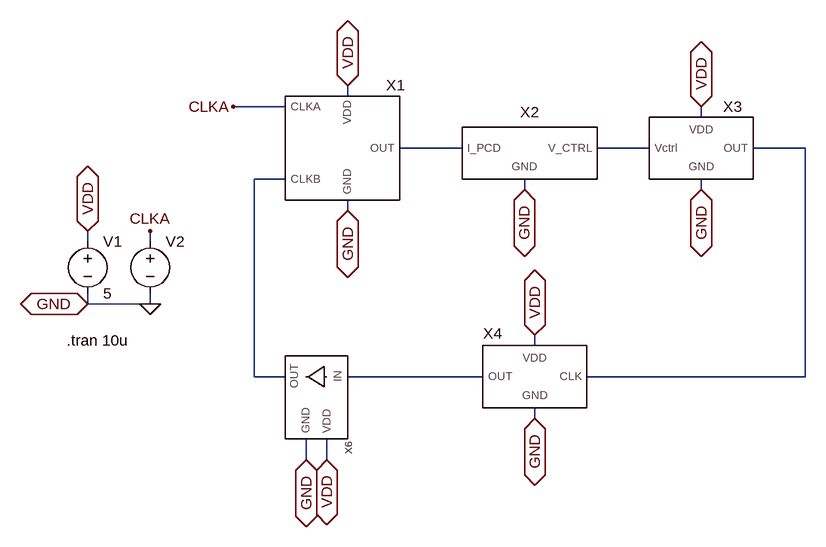
[diagram p0: schematic pll.asc]
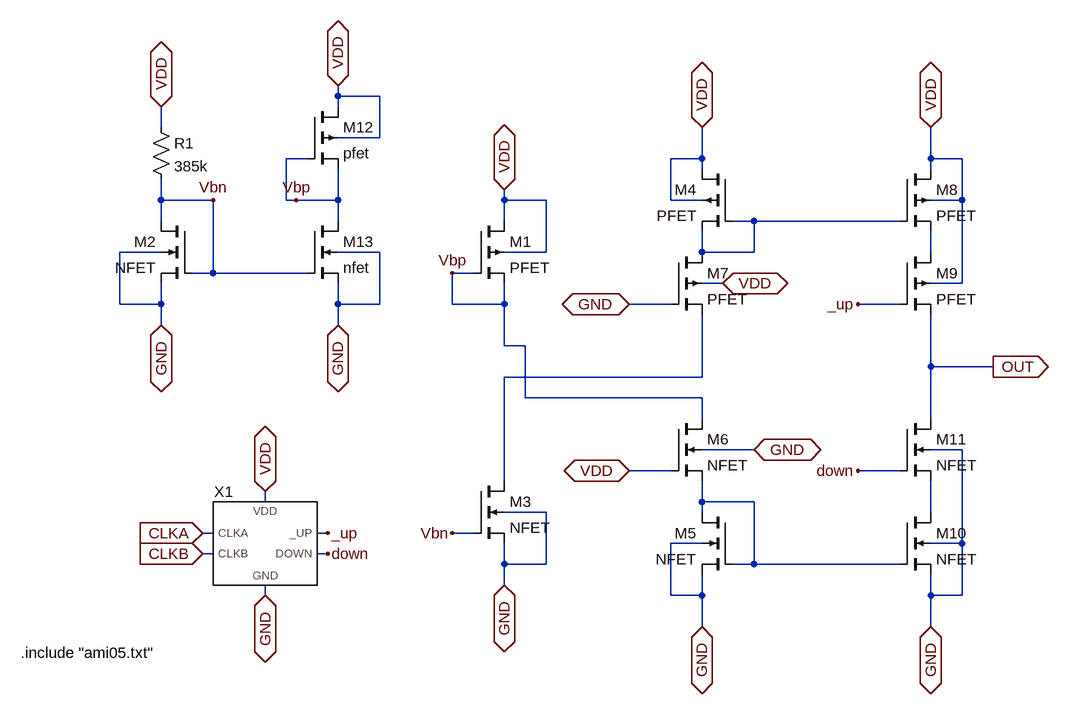
[diagram p1: sub-circuit chargepump.asc]
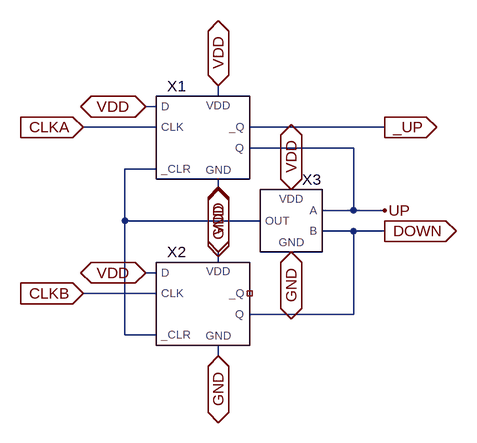
[diagram p2: sub-circuit phasedetector.asc]
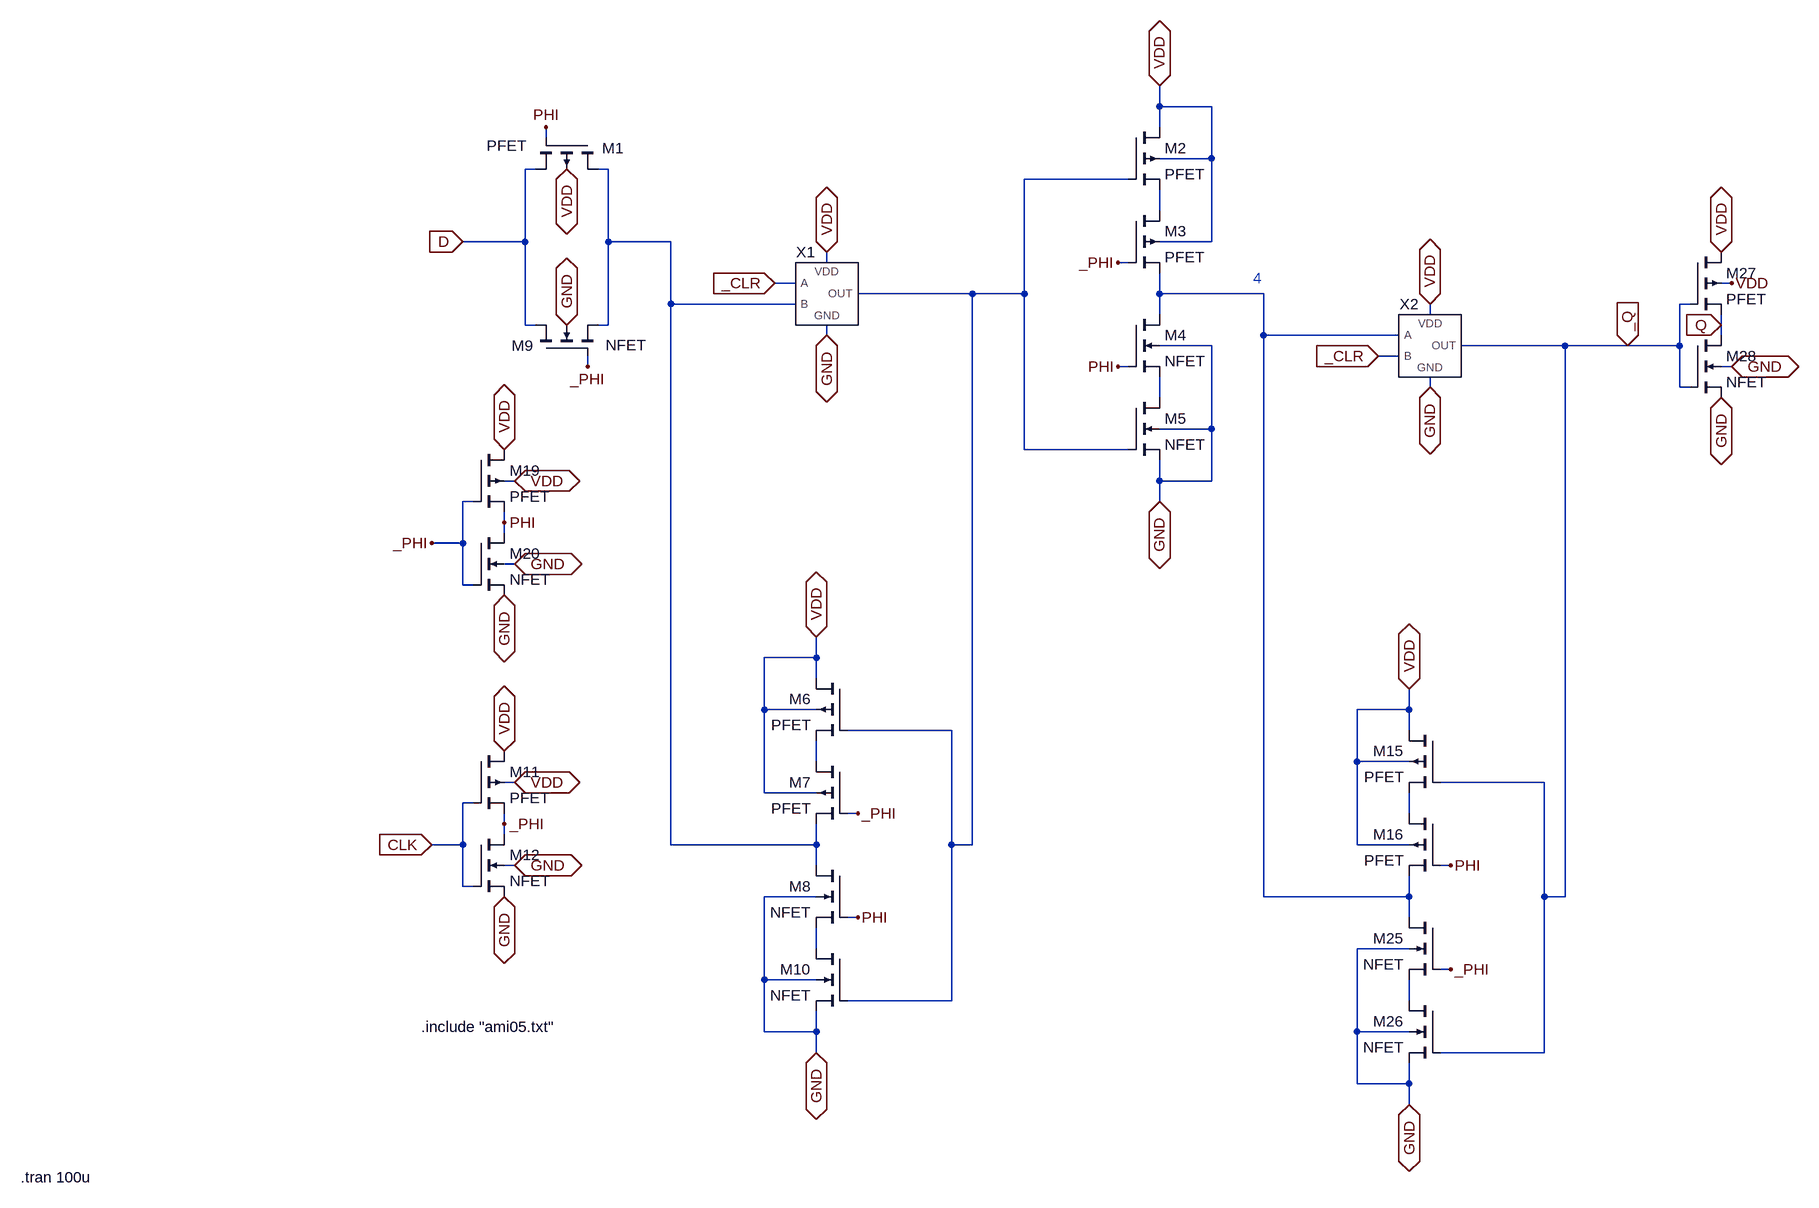
[diagram p3: sub-circuit ffd.asc]
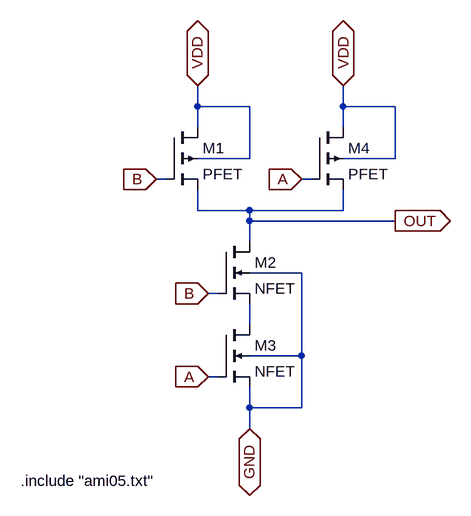
[diagram p4: sub-circuit nand.asc]
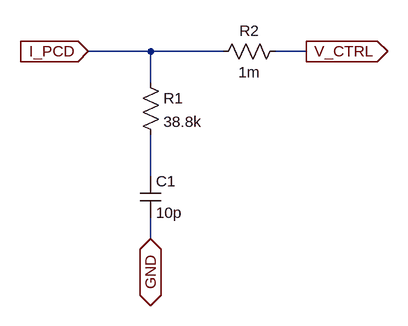
[diagram p5: sub-circuit f_l.asc]
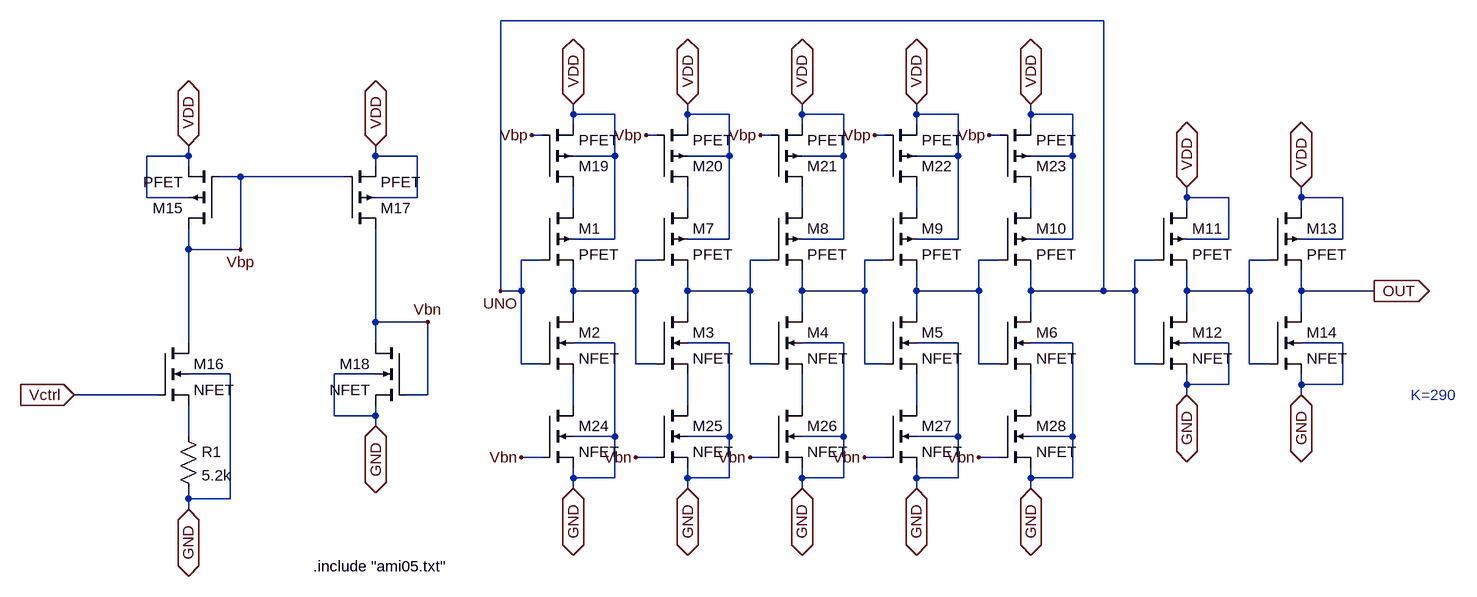
[diagram p6: sub-circuit vco.asc]
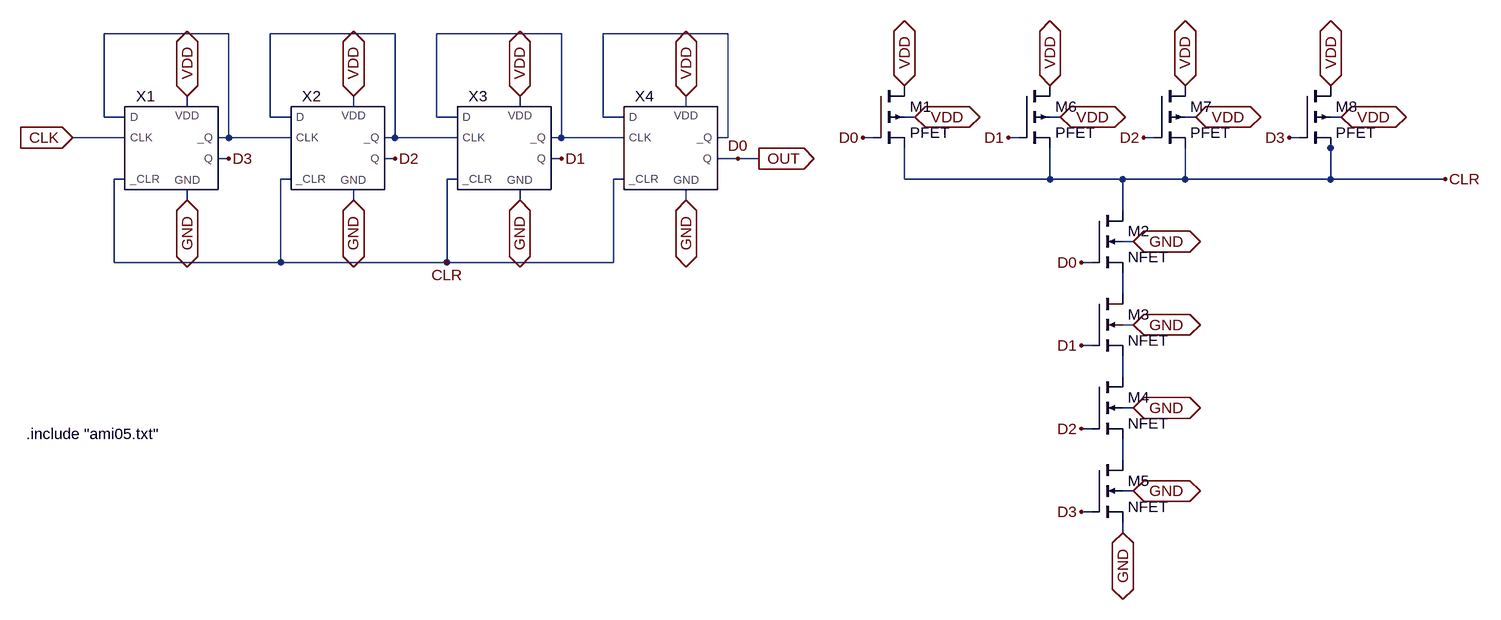
[diagram p7: sub-circuit divisor.asc]
pll.asc, the LTspice schematic file:
Version 4
SHEET 1 880 680
WIRE 48 -32 48 -48
WIRE -48 -16 -128 -16
WIRE 592 0 592 -16
WIRE 224 48 128 48
WIRE 512 48 432 48
WIRE 752 48 672 48
WIRE -48 96 -96 96
WIRE 320 112 320 96
WIRE 592 112 592 96
WIRE 48 144 48 128
WIRE -352 192 -352 176
WIRE -256 192 -256 176
WIRE -352 288 -352 272
WIRE -256 288 -256 272
WIRE -256 288 -352 288
WIRE 336 352 336 336
WIRE -96 400 -96 96
WIRE -48 400 -96 400
WIRE 256 400 48 400
WIRE 752 400 752 48
WIRE 752 400 416 400
WIRE 336 464 336 448
WIRE -16 528 -16 496
WIRE 16 528 16 496
FLAG -256 288 0
FLAG -256 176 CLKA
FLAG -352 176 VDD
IOPIN -352 176 BiDir
FLAG -352 288 GND
IOPIN -352 288 BiDir
FLAG 48 -48 VDD
IOPIN 48 -48 BiDir
FLAG 48 144 GND
IOPIN 48 144 BiDir
FLAG 320 112 GND
IOPIN 320 112 BiDir
FLAG 592 112 GND
IOPIN 592 112 BiDir
FLAG 336 464 GND
IOPIN 336 464 BiDir
FLAG 592 -16 VDD
IOPIN 592 -16 BiDir
FLAG 336 336 VDD
IOPIN 336 336 BiDir
FLAG -128 -16 CLKA
FLAG -16 528 GND
IOPIN -16 528 BiDir
FLAG 16 528 VDD
IOPIN 16 528 BiDir
SYMBOL voltage -352 176 R0
WINDOW 123 0 0 Left 0
WINDOW 39 0 0 Left 0
SYMATTR InstName V1
SYMATTR Value 5
SYMBOL voltage -256 176 R0
WINDOW 3 24 96 Invisible 2
WINDOW 123 0 0 Left 0
WINDOW 39 0 0 Left 0
SYMATTR Value PULSE(0 5 0 10p 10p 33.333n 66.666n)
SYMATTR InstName V2
SYMBOL chargePump 16 64 R0
SYMATTR InstName X1
SYMBOL f_l 320 48 R0
SYMATTR InstName X2
SYMBOL vco 592 48 R0
SYMATTR InstName X3
SYMBOL divisor 336 400 M0
SYMATTR InstName X4
SYMBOL buffer -16 448 R90
SYMATTR InstName X6
TEXT -384 344 Left 2 !.tran 10u

chargepump.asc, the sub-circuit schematic file:
Version 4
SHEET 1 1812 688
WIRE 240 -256 240 -272
WIRE 304 -256 240 -256
WIRE 240 -240 240 -256
WIRE -32 -208 -32 -240
WIRE 304 -192 304 -256
WIRE 304 -192 240 -192
WIRE 192 -160 160 -160
WIRE 800 -160 800 -208
WIRE 800 -160 752 -160
WIRE 1152 -160 1152 -208
WIRE 1200 -160 1152 -160
WIRE 800 -144 800 -160
WIRE 1152 -144 1152 -160
WIRE -32 -96 -32 -128
WIRE 48 -96 -32 -96
WIRE 160 -96 160 -160
WIRE 176 -96 160 -96
WIRE 240 -96 240 -144
WIRE 240 -96 176 -96
WIRE 496 -96 496 -112
WIRE 560 -96 496 -96
WIRE 752 -96 752 -160
WIRE 800 -96 752 -96
WIRE 1200 -96 1200 -160
WIRE 1200 -96 1152 -96
WIRE -32 -64 -32 -96
WIRE 240 -64 240 -96
WIRE 496 -64 496 -96
WIRE 880 -64 848 -64
WIRE 1104 -64 880 -64
WIRE -32 -16 -96 -16
WIRE 304 -16 240 -16
WIRE 560 -16 560 -96
WIRE 560 -16 496 -16
WIRE 800 -16 800 -48
WIRE 880 -16 880 -64
WIRE 880 -16 800 -16
WIRE 1152 -16 1152 -48
WIRE 48 16 48 -96
WIRE 48 16 16 16
WIRE 192 16 48 16
WIRE 448 16 416 16
WIRE 832 32 800 32
WIRE 1200 32 1200 -96
WIRE 1200 32 1152 32
WIRE -96 64 -96 -16
WIRE -32 64 -32 32
WIRE -32 64 -96 64
WIRE 240 64 240 32
WIRE 304 64 304 -16
WIRE 304 64 240 64
WIRE 416 64 416 16
WIRE 496 64 496 32
WIRE 496 64 416 64
WIRE 752 64 688 64
WIRE 1104 64 1040 64
WIRE -32 96 -32 64
WIRE 240 96 240 64
WIRE 496 128 496 64
WIRE 528 128 496 128
WIRE 1152 160 1152 80
WIRE 1248 160 1152 160
WIRE 800 176 800 80
WIRE 800 176 496 176
WIRE 528 208 528 128
WIRE 800 208 528 208
WIRE 800 240 800 208
WIRE 1152 240 1152 160
WIRE 880 288 800 288
WIRE 1200 288 1152 288
WIRE 752 320 688 320
WIRE 1104 320 1040 320
WIRE 496 336 496 176
WIRE 128 368 128 352
WIRE 800 368 800 336
WIRE 880 368 800 368
WIRE 560 384 496 384
WIRE 800 384 800 368
WIRE 1152 384 1152 336
WIRE 48 416 32 416
WIRE 224 416 208 416
WIRE 448 416 416 416
WIRE 800 432 752 432
WIRE 1200 432 1200 288
WIRE 1200 432 1152 432
WIRE 48 448 32 448
WIRE 224 448 208 448
WIRE 496 464 496 432
WIRE 560 464 560 384
WIRE 560 464 496 464
WIRE 880 464 880 368
WIRE 880 464 848 464
WIRE 1104 464 880 464
WIRE 496 496 496 464
WIRE 128 512 128 496
WIRE 752 512 752 432
WIRE 800 512 800 480
WIRE 800 512 752 512
WIRE 1152 512 1152 480
WIRE 1200 512 1200 432
WIRE 1200 512 1152 512
WIRE 800 560 800 512
WIRE 1152 560 1152 512
FLAG -32 -240 VDD
IOPIN -32 -240 BiDir
FLAG -32 96 GND
IOPIN -32 96 BiDir
FLAG 496 496 GND
IOPIN 496 496 BiDir
FLAG 48 -96 Vbn
FLAG 416 16 Vbp
FLAG 496 -112 VDD
IOPIN 496 -112 BiDir
FLAG 416 416 Vbn
FLAG 224 448 down
FLAG 128 352 VDD
IOPIN 128 352 BiDir
FLAG 128 512 GND
IOPIN 128 512 BiDir
FLAG 224 416 _up
FLAG 32 448 CLKB
IOPIN 32 448 In
FLAG 32 416 CLKA
IOPIN 32 416 In
FLAG 176 -96 Vbp
FLAG 240 96 GND
IOPIN 240 96 BiDir
FLAG 240 -272 VDD
IOPIN 240 -272 BiDir
FLAG 1040 64 _up
FLAG 1040 320 down
FLAG 688 320 VDD
IOPIN 688 320 BiDir
FLAG 800 -208 VDD
IOPIN 800 -208 BiDir
FLAG 1152 -208 VDD
IOPIN 1152 -208 BiDir
FLAG 832 32 VDD
IOPIN 832 32 BiDir
FLAG 800 560 GND
IOPIN 800 560 BiDir
FLAG 1152 560 GND
IOPIN 1152 560 BiDir
FLAG 688 64 GND
IOPIN 688 64 BiDir
FLAG 1248 160 OUT
IOPIN 1248 160 Out
FLAG 880 288 GND
IOPIN 880 288 BiDir
SYMBOL pmos4 448 -64 R0
SYMATTR InstName M1
SYMATTR Value2 l=1.2u w=7.8u
SYMATTR Value PFET
SYMBOL nmos4 16 -64 M0
SYMATTR InstName M2
SYMATTR Value2 l=1.2u w=2.4u
SYMATTR Value NFET
SYMBOL res -48 -224 R0
SYMATTR InstName R1
SYMATTR Value 385k
SYMBOL nmos4 448 336 R0
SYMATTR InstName M3
SYMATTR Value2 l=1.2u w=2.4u
SYMATTR Value NFET
SYMBOL phaseDetector 128 432 R0
SYMATTR InstName X1
SYMBOL pmos4 192 -240 R0
SYMATTR InstName M12
SYMATTR Value pfet
SYMATTR Value2 l=1.2u w=7.8u
SYMBOL nmos4 192 -64 R0
SYMATTR InstName M13
SYMATTR Value nfet
SYMATTR Value2 l=1.2u w=2.4u
SYMBOL pmos4 848 -144 M0
SYMATTR InstName M4
SYMATTR Value PFET
SYMATTR Value2 l=1.2u w=7.8u
SYMBOL nmos4 848 384 M0
SYMATTR InstName M5
SYMATTR Value NFET
SYMATTR Value2 l=1.2u w=2.4u
SYMBOL nmos4 752 240 R0
SYMATTR InstName M6
SYMATTR Value NFET
SYMATTR Value2 l=0.6u w=1.5u
SYMBOL pmos4 752 -16 R0
SYMATTR InstName M7
SYMATTR Value PFET
SYMATTR Value2 l=0.6u w=3u
SYMBOL pmos4 1104 -144 R0
SYMATTR InstName M8
SYMATTR Value PFET
SYMATTR Value2 l=1.2u w=7.8u
SYMBOL pmos4 1104 -16 R0
SYMATTR InstName M9
SYMATTR Value PFET
SYMATTR Value2 l=0.6u w=3u
SYMBOL nmos4 1104 384 R0
SYMATTR InstName M10
SYMATTR Value NFET
SYMATTR Value2 l=1.2u w=2.4u
SYMBOL nmos4 1104 240 R0
SYMATTR InstName M11
SYMATTR Value NFET
SYMATTR Value2 l=0.6u w=1.5u
TEXT -248 600 Left 2 !.include "ami05.txt"

phasedetector.asc, the sub-circuit schematic file:
Version 4
SHEET 1 880 680
WIRE 176 64 176 48
WIRE 80 80 64 80
WIRE 80 112 -32 112
WIRE 432 112 224 112
WIRE 384 144 224 144
WIRE 80 176 32 176
WIRE 176 208 176 192
WIRE 384 240 384 144
WIRE 384 240 336 240
WIRE 432 240 384 240
WIRE 32 256 32 176
WIRE 240 256 32 256
WIRE 384 272 336 272
WIRE 432 272 384 272
WIRE 176 320 176 304
WIRE 80 336 64 336
WIRE 80 368 -32 368
WIRE 384 400 384 272
WIRE 384 400 224 400
WIRE 32 432 32 256
WIRE 80 432 32 432
WIRE 176 464 176 448
FLAG 176 464 GND
IOPIN 176 464 BiDir
FLAG 176 208 GND
IOPIN 176 208 BiDir
FLAG 176 304 VDD
IOPIN 176 304 BiDir
FLAG 176 48 VDD
IOPIN 176 48 BiDir
FLAG 64 80 VDD
IOPIN 64 80 BiDir
FLAG 64 336 VDD
IOPIN 64 336 BiDir
FLAG -32 112 CLKA
IOPIN -32 112 In
FLAG -32 368 CLKB
IOPIN -32 368 In
FLAG 288 208 VDD
IOPIN 288 208 BiDir
FLAG 288 304 GND
IOPIN 288 304 BiDir
FLAG 432 112 _UP
IOPIN 432 112 Out
FLAG 432 272 DOWN
IOPIN 432 272 Out
FLAG 432 240 UP
SYMBOL FFD 160 144 R0
SYMATTR InstName X1
SYMBOL FFD 160 400 R0
SYMATTR InstName X2
SYMBOL NAND 288 256 M0
SYMATTR InstName X3

ffd.asc, the sub-circuit schematic file:
Version 4
SHEET 1 2988 1332
WIRE 992 -336 992 -368
WIRE 1072 -336 992 -336
WIRE 992 -304 992 -336
WIRE 48 -288 48 -304
WIRE 1072 -256 1072 -336
WIRE 1072 -256 992 -256
WIRE 32 -240 16 -240
WIRE 144 -240 128 -240
WIRE 944 -224 784 -224
WIRE 992 -176 992 -208
WIRE 16 -128 16 -240
WIRE 16 -128 -80 -128
WIRE 144 -128 144 -240
WIRE 240 -128 144 -128
WIRE 1072 -128 1072 -256
WIRE 1072 -128 992 -128
WIRE 480 -96 480 -112
WIRE 944 -96 928 -96
WIRE 432 -64 400 -64
WIRE 1872 -64 1856 -64
WIRE 704 -48 528 -48
WIRE 784 -48 784 -224
WIRE 784 -48 704 -48
WIRE 992 -48 992 -80
WIRE 1152 -48 992 -48
WIRE 240 -32 240 -128
WIRE 432 -32 240 -32
WIRE 1808 -32 1792 -32
WIRE 992 -16 992 -48
WIRE 1408 -16 1408 -32
WIRE 16 0 16 -128
WIRE 32 0 16 0
WIRE 144 0 144 -128
WIRE 144 0 128 0
WIRE 1856 0 1856 -16
WIRE 480 16 480 0
WIRE 1152 16 1152 -48
WIRE 1360 16 1152 16
WIRE 1856 16 1856 0
WIRE 1072 32 992 32
WIRE 1616 32 1456 32
WIRE 1712 32 1616 32
WIRE 1792 32 1792 -32
WIRE 1792 32 1712 32
WIRE 1360 48 1328 48
WIRE 112 64 112 48
WIRE 944 64 928 64
WIRE 1872 64 1856 64
WIRE 1408 96 1408 80
WIRE 1792 96 1792 32
WIRE 1808 96 1792 96
WIRE 992 112 992 80
WIRE 1072 160 1072 32
WIRE 1072 160 992 160
WIRE 784 192 784 -48
WIRE 944 192 784 192
WIRE 0 240 -16 240
WIRE 992 240 992 208
WIRE 1072 240 1072 160
WIRE 1072 240 992 240
WIRE -64 272 -80 272
WIRE 992 272 992 240
WIRE -16 304 -16 288
WIRE -16 320 -16 304
WIRE -80 336 -80 272
WIRE -80 336 -128 336
WIRE 0 368 -16 368
WIRE -80 400 -80 336
WIRE -64 400 -80 400
WIRE 464 512 464 480
WIRE 464 512 384 512
WIRE 464 544 464 512
WIRE 384 592 384 512
WIRE 464 592 384 592
WIRE 1376 592 1376 560
WIRE 1376 592 1296 592
WIRE 672 624 512 624
WIRE 1376 624 1376 592
WIRE 464 672 464 640
WIRE 1296 672 1296 592
WIRE 1376 672 1296 672
WIRE 0 704 -16 704
WIRE 1584 704 1424 704
WIRE 384 720 384 592
WIRE 464 720 384 720
WIRE -64 736 -80 736
WIRE 528 752 512 752
WIRE 1376 752 1376 720
WIRE -16 768 -16 752
WIRE -16 784 -16 768
WIRE -80 800 -80 736
WIRE -80 800 -128 800
WIRE 240 800 240 -32
WIRE 464 800 464 768
WIRE 464 800 240 800
WIRE 672 800 672 624
WIRE 704 800 704 -48
WIRE 704 800 672 800
WIRE 1296 800 1296 672
WIRE 1376 800 1296 800
WIRE 0 832 -16 832
WIRE 464 832 464 800
WIRE 1440 832 1424 832
WIRE -80 864 -80 800
WIRE -64 864 -80 864
WIRE 464 880 384 880
WIRE 1152 880 1152 16
WIRE 1376 880 1376 848
WIRE 1376 880 1152 880
WIRE 1584 880 1584 704
WIRE 1616 880 1616 32
WIRE 1616 880 1584 880
WIRE 528 912 512 912
WIRE 1376 912 1376 880
WIRE 464 960 464 928
WIRE 1376 960 1296 960
WIRE 1440 992 1424 992
WIRE 384 1008 384 880
WIRE 464 1008 384 1008
WIRE 672 1040 672 800
WIRE 672 1040 512 1040
WIRE 1376 1040 1376 1008
WIRE 384 1088 384 1008
WIRE 464 1088 464 1056
WIRE 464 1088 384 1088
WIRE 1296 1088 1296 960
WIRE 1376 1088 1296 1088
WIRE 464 1120 464 1088
WIRE 1584 1120 1584 880
WIRE 1584 1120 1424 1120
WIRE 1296 1168 1296 1088
WIRE 1376 1168 1376 1136
WIRE 1376 1168 1296 1168
WIRE 1376 1200 1376 1168
FLAG 80 -240 VDD
IOPIN 80 -240 BiDir
FLAG 48 -304 PHI
FLAG 112 64 _PHI
FLAG -80 -128 D
IOPIN -80 -128 In
FLAG 0 704 VDD
IOPIN 0 704 BiDir
FLAG -16 768 _PHI
FLAG -128 800 CLK
IOPIN -128 800 In
FLAG -16 880 GND
IOPIN -16 880 BiDir
FLAG 0 832 GND
IOPIN 0 832 BiDir
FLAG 80 0 GND
IOPIN 80 0 BiDir
FLAG 0 240 VDD
IOPIN 0 240 BiDir
FLAG -16 304 PHI
FLAG -128 336 _PHI
FLAG -16 416 GND
IOPIN -16 416 BiDir
FLAG 0 368 GND
IOPIN 0 368 BiDir
FLAG -16 192 VDD
IOPIN -16 192 BiDir
FLAG -16 656 VDD
IOPIN -16 656 BiDir
FLAG 992 -368 VDD
IOPIN 992 -368 BiDir
FLAG 992 272 GND
IOPIN 992 272 BiDir
FLAG 928 -96 _PHI
FLAG 928 64 PHI
FLAG 464 480 VDD
IOPIN 464 480 BiDir
FLAG 464 1120 GND
IOPIN 464 1120 BiDir
FLAG 528 752 _PHI
FLAG 528 912 PHI
FLAG 1376 560 VDD
IOPIN 1376 560 BiDir
FLAG 1376 1200 GND
IOPIN 1376 1200 BiDir
FLAG 1440 832 PHI
FLAG 1440 992 _PHI
FLAG 1872 -64 VDD
FLAG 1856 0 Q
IOPIN 1856 0 In
FLAG 1856 112 GND
IOPIN 1856 112 BiDir
FLAG 1872 64 GND
IOPIN 1872 64 BiDir
FLAG 1856 -112 VDD
IOPIN 1856 -112 BiDir
FLAG 1712 32 _Q
IOPIN 1712 32 In
FLAG 480 16 GND
IOPIN 480 16 BiDir
FLAG 1408 96 GND
IOPIN 1408 96 BiDir
FLAG 1408 -32 VDD
IOPIN 1408 -32 BiDir
FLAG 480 -112 VDD
IOPIN 480 -112 BiDir
FLAG 400 -64 _CLR
IOPIN 400 -64 In
FLAG 1328 48 _CLR
IOPIN 1328 48 In
SYMBOL pmos4 128 -288 R90
WINDOW 0 16 -40 VRight 2
WINDOW 3 12 110 VRight 2
SYMATTR InstName M1
SYMATTR Value PFET
SYMATTR Value2 l=600n w=6u
SYMBOL nmos4 32 48 R270
WINDOW 0 16 -37 VRight 2
WINDOW 3 17 108 VRight 2
SYMATTR InstName M9
SYMATTR Value NFET
SYMATTR Value2 l=600n w=3u
SYMBOL pmos4 -64 192 R0
SYMATTR InstName M19
SYMATTR Value2 l=600n w=3u
SYMATTR Value PFET
SYMBOL nmos4 -64 320 R0
SYMATTR InstName M20
SYMATTR Value2 l=600n w=1.5u
SYMATTR Value NFET
SYMBOL pmos4 944 -304 R0
SYMATTR InstName M2
SYMATTR Value2 l=600n w=6u
SYMATTR Value PFET
SYMBOL pmos4 944 -176 R0
SYMATTR InstName M3
SYMATTR Value2 l=600n w=6u
SYMATTR Value PFET
SYMBOL nmos4 944 -16 R0
SYMATTR InstName M4
SYMATTR Value2 l=600n w=3u
SYMATTR Value NFET
SYMBOL nmos4 944 112 R0
SYMATTR InstName M5
SYMATTR Value2 l=600n w=3u
SYMATTR Value NFET
SYMBOL pmos4 512 544 M0
SYMATTR InstName M6
SYMATTR Value2 l=600n w=6u
SYMATTR Value PFET
SYMBOL pmos4 512 672 M0
SYMATTR InstName M7
SYMATTR Value2 l=600n w=6u
SYMATTR Value PFET
SYMBOL nmos4 512 832 M0
SYMATTR InstName M8
SYMATTR Value2 l=600n w=3u
SYMATTR Value NFET
SYMBOL nmos4 512 960 M0
SYMATTR InstName M10
SYMATTR Value2 l=600n w=3u
SYMATTR Value NFET
SYMBOL pmos4 1424 624 M0
SYMATTR InstName M15
SYMATTR Value2 l=600n w=6u
SYMATTR Value PFET
SYMBOL pmos4 1424 752 M0
SYMATTR InstName M16
SYMATTR Value2 l=600n w=6u
SYMATTR Value PFET
SYMBOL nmos4 1424 912 M0
SYMATTR InstName M25
SYMATTR Value2 l=600n w=3u
SYMATTR Value NFET
SYMBOL nmos4 1424 1040 M0
SYMATTR InstName M26
SYMATTR Value2 l=600n w=3u
SYMATTR Value NFET
SYMBOL pmos4 1808 -112 R0
SYMATTR InstName M27
SYMATTR Value2 l=600n w=3u
SYMATTR Value PFET
SYMBOL nmos4 1808 16 R0
SYMATTR InstName M28
SYMATTR Value2 l=600n w=1.5u
SYMATTR Value NFET
SYMBOL NAND 480 -48 R0
SYMATTR InstName X1
SYMBOL NAND 1408 32 R0
SYMATTR InstName X2
SYMBOL pmos4 -64 656 R0
SYMATTR InstName M11
SYMATTR Value2 l=600n w=3u
SYMATTR Value PFET
SYMBOL nmos4 -64 784 R0
SYMATTR InstName M12
SYMATTR Value2 l=600n w=1.5u
SYMATTR Value NFET
TEXT -144 1080 Left 2 !.include "ami05.txt"
TEXT -760 1312 Left 2 !.tran 100u
TEXT 1136 -72 Left 2 ;4

nand.asc, the sub-circuit schematic file:
Version 4
SHEET 1 880 680
WIRE 32 -96 32 -128
WIRE 112 -96 32 -96
WIRE 256 -96 256 -128
WIRE 336 -96 256 -96
WIRE 32 -64 32 -96
WIRE 256 -64 256 -96
WIRE 112 -16 112 -96
WIRE 112 -16 32 -16
WIRE 336 -16 336 -96
WIRE 336 -16 256 -16
WIRE -16 16 -32 16
WIRE 208 16 192 16
WIRE 32 64 32 32
WIRE 112 64 32 64
WIRE 256 64 256 32
WIRE 256 64 112 64
WIRE 112 80 112 64
WIRE 336 80 112 80
WIRE 112 112 112 80
WIRE 192 160 112 160
WIRE 64 192 48 192
WIRE 112 240 112 208
WIRE 192 288 192 160
WIRE 192 288 112 288
WIRE 64 320 48 320
WIRE 112 368 112 336
WIRE 192 368 192 288
WIRE 192 368 112 368
WIRE 112 400 112 368
FLAG 112 400 GND
IOPIN 112 400 BiDir
FLAG 32 -128 VDD
IOPIN 32 -128 BiDir
FLAG 256 -128 VDD
IOPIN 256 -128 BiDir
FLAG 192 16 A
IOPIN 192 16 In
FLAG 48 320 A
IOPIN 48 320 In
FLAG 48 192 B
IOPIN 48 192 In
FLAG -32 16 B
IOPIN -32 16 In
FLAG 336 80 OUT
IOPIN 336 80 Out
SYMBOL pmos4 -16 -64 R0
SYMATTR InstName M1
SYMATTR Value2 l=600n w=3u
SYMATTR Value PFET
SYMBOL nmos4 64 112 R0
SYMATTR InstName M2
SYMATTR Value2 l=600n w=3u
SYMATTR Value NFET
SYMBOL nmos4 64 240 R0
SYMATTR InstName M3
SYMATTR Value2 l=600n w=3u
SYMATTR Value NFET
SYMBOL pmos4 208 -64 R0
SYMATTR InstName M4
SYMATTR Value2 l=600n w=3u
SYMATTR Value PFET
TEXT -240 480 Left 2 !.include "ami05.txt"

f_l.asc, the sub-circuit schematic file:
Version 4
SHEET 1 880 680
WIRE 96 64 0 64
WIRE 208 64 96 64
WIRE 336 64 288 64
WIRE 96 112 96 64
WIRE 96 256 96 192
WIRE 96 352 96 320
FLAG 0 64 I_PCD
IOPIN 0 64 In
FLAG 336 64 V_CTRL
IOPIN 336 64 Out
FLAG 96 352 GND
IOPIN 96 352 BiDir
SYMBOL res 80 96 R0
SYMATTR InstName R1
SYMATTR Value 38.8k
SYMBOL res 304 48 R90
WINDOW 0 0 56 VBottom 2
WINDOW 3 32 56 VTop 2
SYMATTR InstName R2
SYMATTR Value 1m
SYMBOL cap 80 256 R0
SYMATTR InstName C1
SYMATTR Value 10p

vco.asc, the sub-circuit schematic file:
Version 4
SHEET 1 1320 768
WIRE 768 -240 -160 -240
WIRE -48 -96 -48 -112
WIRE 16 -96 -48 -96
WIRE 128 -96 128 -112
WIRE 192 -96 128 -96
WIRE 304 -96 304 -112
WIRE 368 -96 304 -96
WIRE 480 -96 480 -112
WIRE 544 -96 480 -96
WIRE 656 -96 656 -112
WIRE 720 -96 656 -96
WIRE -48 -80 -48 -96
WIRE 128 -80 128 -96
WIRE 304 -80 304 -96
WIRE 480 -80 480 -96
WIRE 656 -80 656 -96
WIRE -96 -64 -112 -64
WIRE 80 -64 64 -64
WIRE 256 -64 240 -64
WIRE 432 -64 416 -64
WIRE 608 -64 592 -64
WIRE -640 -32 -640 -48
WIRE -640 -32 -704 -32
WIRE -352 -32 -352 -48
WIRE -288 -32 -352 -32
WIRE 16 -32 16 -96
WIRE 16 -32 -48 -32
WIRE 192 -32 192 -96
WIRE 192 -32 128 -32
WIRE 368 -32 368 -96
WIRE 368 -32 304 -32
WIRE 544 -32 544 -96
WIRE 544 -32 480 -32
WIRE 720 -32 720 -96
WIRE 720 -32 656 -32
WIRE -640 -16 -640 -32
WIRE -352 -16 -352 -32
WIRE -560 0 -592 0
WIRE -400 0 -560 0
WIRE -704 32 -704 -32
WIRE -640 32 -704 32
WIRE -288 32 -288 -32
WIRE -288 32 -352 32
WIRE 896 32 896 16
WIRE 960 32 896 32
WIRE 1072 32 1072 16
WIRE 1136 32 1072 32
WIRE -48 48 -48 16
WIRE 128 48 128 16
WIRE 304 48 304 16
WIRE 480 48 480 16
WIRE 656 48 656 16
WIRE 896 48 896 32
WIRE 1072 48 1072 32
WIRE 16 96 16 -32
WIRE 16 96 -48 96
WIRE 192 96 192 -32
WIRE 192 96 128 96
WIRE 368 96 368 -32
WIRE 368 96 304 96
WIRE 544 96 544 -32
WIRE 544 96 480 96
WIRE 720 96 720 -32
WIRE 720 96 656 96
WIRE 960 96 960 32
WIRE 960 96 896 96
WIRE 1136 96 1136 32
WIRE 1136 96 1072 96
WIRE -640 112 -640 80
WIRE -560 112 -560 0
WIRE -560 112 -640 112
WIRE -96 128 -128 128
WIRE 80 128 48 128
WIRE 256 128 224 128
WIRE 432 128 400 128
WIRE 608 128 576 128
WIRE 848 128 816 128
WIRE 1024 128 992 128
WIRE -160 176 -160 -240
WIRE -128 176 -128 128
WIRE -128 176 -160 176
WIRE -48 176 -48 144
WIRE 48 176 48 128
WIRE 48 176 -48 176
WIRE 128 176 128 144
WIRE 224 176 224 128
WIRE 224 176 128 176
WIRE 304 176 304 144
WIRE 400 176 400 128
WIRE 400 176 304 176
WIRE 480 176 480 144
WIRE 576 176 576 128
WIRE 576 176 480 176
WIRE 656 176 656 144
WIRE 768 176 768 -240
WIRE 768 176 656 176
WIRE 816 176 816 128
WIRE 816 176 768 176
WIRE 896 176 896 144
WIRE 992 176 992 128
WIRE 992 176 896 176
WIRE 1072 176 1072 144
WIRE 1184 176 1072 176
WIRE -48 208 -48 176
WIRE 128 208 128 176
WIRE 304 208 304 176
WIRE 480 208 480 176
WIRE 656 208 656 176
WIRE 896 208 896 176
WIRE 1072 208 1072 176
WIRE -352 224 -352 80
WIRE -272 224 -352 224
WIRE -640 256 -640 112
WIRE -352 256 -352 224
WIRE 16 256 -48 256
WIRE 192 256 128 256
WIRE 368 256 304 256
WIRE 544 256 480 256
WIRE 720 256 656 256
WIRE 960 256 896 256
WIRE 1136 256 1072 256
WIRE -128 288 -128 176
WIRE -96 288 -128 288
WIRE 48 288 48 176
WIRE 80 288 48 288
WIRE 224 288 224 176
WIRE 256 288 224 288
WIRE 400 288 400 176
WIRE 432 288 400 288
WIRE 576 288 576 176
WIRE 608 288 576 288
WIRE 816 288 816 176
WIRE 848 288 816 288
WIRE 992 288 992 176
WIRE 1024 288 992 288
WIRE -576 304 -640 304
WIRE -352 304 -416 304
WIRE 896 320 896 304
WIRE 960 320 960 256
WIRE 960 320 896 320
WIRE 1072 320 1072 304
WIRE 1136 320 1136 256
WIRE 1136 320 1072 320
WIRE -688 336 -816 336
WIRE -272 336 -272 224
WIRE -272 336 -304 336
WIRE 896 336 896 320
WIRE 1072 336 1072 320
WIRE -48 352 -48 304
WIRE 128 352 128 304
WIRE 304 352 304 304
WIRE 480 352 480 304
WIRE 656 352 656 304
WIRE -416 368 -416 304
WIRE -352 368 -352 352
WIRE -352 368 -416 368
WIRE -352 384 -352 368
WIRE -640 400 -640 352
WIRE 16 400 16 256
WIRE 16 400 -48 400
WIRE 192 400 192 256
WIRE 192 400 128 400
WIRE 368 400 368 256
WIRE 368 400 304 400
WIRE 544 400 544 256
WIRE 544 400 480 400
WIRE 720 400 720 256
WIRE 720 400 656 400
WIRE -96 432 -128 432
WIRE 80 432 48 432
WIRE 256 432 224 432
WIRE 432 432 400 432
WIRE 608 432 576 432
WIRE -48 464 -48 448
WIRE 16 464 16 400
WIRE 16 464 -48 464
WIRE 128 464 128 448
WIRE 192 464 192 400
WIRE 192 464 128 464
WIRE 304 464 304 448
WIRE 368 464 368 400
WIRE 368 464 304 464
WIRE 480 464 480 448
WIRE 544 464 544 400
WIRE 544 464 480 464
WIRE 656 464 656 448
WIRE 720 464 720 400
WIRE 720 464 656 464
WIRE -48 480 -48 464
WIRE 128 480 128 464
WIRE 304 480 304 464
WIRE 480 480 480 464
WIRE 656 480 656 464
WIRE -640 496 -640 480
WIRE -576 496 -576 304
WIRE -576 496 -640 496
WIRE -640 512 -640 496
FLAG 896 16 VDD
IOPIN 896 16 BiDir
FLAG 896 336 GND
IOPIN 896 336 BiDir
FLAG 1072 16 VDD
IOPIN 1072 16 BiDir
FLAG 1072 336 GND
IOPIN 1072 336 BiDir
FLAG -160 176 UNO
FLAG -640 -48 VDD
IOPIN -640 -48 BiDir
FLAG -352 -48 VDD
IOPIN -352 -48 BiDir
FLAG -640 512 GND
IOPIN -640 512 BiDir
FLAG -352 384 GND
IOPIN -352 384 BiDir
FLAG -48 -112 VDD
IOPIN -48 -112 BiDir
FLAG -112 -64 Vbp
FLAG 128 -112 VDD
IOPIN 128 -112 BiDir
FLAG 64 -64 Vbp
FLAG 304 -112 VDD
IOPIN 304 -112 BiDir
FLAG 240 -64 Vbp
FLAG 480 -112 VDD
IOPIN 480 -112 BiDir
FLAG 416 -64 Vbp
FLAG 656 -112 VDD
IOPIN 656 -112 BiDir
FLAG 592 -64 Vbp
FLAG -560 112 Vbp
FLAG -272 224 Vbn
FLAG -48 480 GND
IOPIN -48 480 BiDir
FLAG -128 432 Vbn
FLAG 128 480 GND
IOPIN 128 480 BiDir
FLAG 48 432 Vbn
FLAG 304 480 GND
IOPIN 304 480 BiDir
FLAG 224 432 Vbn
FLAG 480 480 GND
IOPIN 480 480 BiDir
FLAG 400 432 Vbn
FLAG 656 480 GND
IOPIN 656 480 BiDir
FLAG 576 432 Vbn
FLAG -816 336 Vctrl
IOPIN -816 336 In
FLAG 1184 176 OUT
IOPIN 1184 176 Out
SYMBOL pmos4 -96 48 R0
SYMATTR InstName M1
SYMATTR Value2 l=0.9u w=3u
SYMATTR Value PFET
SYMBOL nmos4 -96 208 R0
SYMATTR InstName M2
SYMATTR Value2 l=0.9u w=1.5u
SYMATTR Value NFET
SYMBOL pmos4 848 48 R0
SYMATTR InstName M11
SYMATTR Value2 l=0.6u w=3u
SYMATTR Value PFET
SYMBOL nmos4 848 208 R0
SYMATTR InstName M12
SYMATTR Value2 l=0.6u w=1.5u
SYMATTR Value NFET
SYMBOL pmos4 1024 48 R0
SYMATTR InstName M13
SYMATTR Value2 l=0.6u w=3u
SYMATTR Value PFET
SYMBOL nmos4 1024 208 R0
SYMATTR InstName M14
SYMATTR Value2 l=0.6u w=1.5u
SYMATTR Value NFET
SYMBOL pmos4 -592 80 R180
SYMATTR InstName M15
SYMATTR Value2 l=0.9u w=6.3u
SYMATTR Value PFET
SYMBOL nmos4 -688 256 R0
SYMATTR InstName M16
SYMATTR Value2 l=0.6u w=5.1u
SYMATTR Value NFET
SYMBOL pmos4 -400 80 M180
SYMATTR InstName M17
SYMATTR Value2 l=0.9u w=6.3u
SYMATTR Value PFET
SYMBOL nmos4 -304 256 M0
SYMATTR InstName M18
SYMATTR Value2 l=0.9u w=2.1u
SYMATTR Value NFET
SYMBOL res -656 384 R0
SYMATTR InstName R1
SYMATTR Value 5.2k
SYMBOL pmos4 -96 16 M180
SYMATTR InstName M19
SYMATTR Value2 l=0.9u w=6.3u
SYMATTR Value PFET
SYMBOL pmos4 80 16 M180
SYMATTR InstName M20
SYMATTR Value2 l=0.9u w=6.3u
SYMATTR Value PFET
SYMBOL pmos4 256 16 M180
SYMATTR InstName M21
SYMATTR Value2 l=0.9u w=6.3u
SYMATTR Value PFET
SYMBOL pmos4 432 16 M180
SYMATTR InstName M22
SYMATTR Value2 l=0.9u w=6.3u
SYMATTR Value PFET
SYMBOL pmos4 608 16 M180
SYMATTR InstName M23
SYMATTR Value2 l=0.9u w=6.3u
SYMATTR Value PFET
SYMBOL nmos4 -96 352 R0
SYMATTR InstName M24
SYMATTR Value2 l=0.9u w=2.1u
SYMATTR Value NFET
SYMBOL nmos4 80 352 R0
SYMATTR InstName M25
SYMATTR Value2 l=0.9u w=2.1u
SYMATTR Value NFET
SYMBOL nmos4 256 352 R0
SYMATTR InstName M26
SYMATTR Value2 l=0.9u w=2.1u
SYMATTR Value NFET
SYMBOL nmos4 432 352 R0
SYMATTR InstName M27
SYMATTR Value2 l=0.9u w=2.1u
SYMATTR Value NFET
SYMBOL nmos4 608 352 R0
SYMATTR InstName M28
SYMATTR Value2 l=0.9u w=2.1u
SYMATTR Value NFET
SYMBOL pmos4 80 48 R0
SYMATTR InstName M7
SYMATTR Value2 l=0.9u w=3u
SYMATTR Value PFET
SYMBOL pmos4 256 48 R0
SYMATTR InstName M8
SYMATTR Value2 l=0.9u w=3u
SYMATTR Value PFET
SYMBOL pmos4 432 48 R0
SYMATTR InstName M9
SYMATTR Value2 l=0.9u w=3u
SYMATTR Value PFET
SYMBOL pmos4 608 48 R0
SYMATTR InstName M10
SYMATTR Value2 l=0.9u w=3u
SYMATTR Value PFET
SYMBOL nmos4 80 208 R0
SYMATTR InstName M3
SYMATTR Value2 l=0.9u w=1.5u
SYMATTR Value NFET
SYMBOL nmos4 256 208 R0
SYMATTR InstName M4
SYMATTR Value2 l=0.9u w=1.5u
SYMATTR Value NFET
SYMBOL nmos4 432 208 R0
SYMATTR InstName M5
SYMATTR Value2 l=0.9u w=1.5u
SYMATTR Value NFET
SYMBOL nmos4 608 208 R0
SYMATTR InstName M6
SYMATTR Value2 l=0.9u w=1.5u
SYMATTR Value NFET
TEXT -448 600 Left 2 !.include "ami05.txt"
TEXT 1240 336 Left 2 ;K=290

divisor.asc, the sub-circuit schematic file:
Version 4
SHEET 1 2576 1504
WIRE 192 -16 0 -16
WIRE 448 -16 256 -16
WIRE 704 -16 512 -16
WIRE 960 -16 768 -16
WIRE 128 96 128 80
WIRE 384 96 384 80
WIRE 640 96 640 80
WIRE 896 96 896 80
WIRE 0 112 0 -16
WIRE 32 112 0 112
WIRE 256 112 256 -16
WIRE 288 112 256 112
WIRE 512 112 512 -16
WIRE 544 112 512 112
WIRE 768 112 768 -16
WIRE 800 112 768 112
WIRE 1248 112 1232 112
WIRE 1472 112 1456 112
WIRE 1680 112 1664 112
WIRE 1904 112 1888 112
WIRE 32 144 -48 144
WIRE 192 144 192 -16
WIRE 192 144 176 144
WIRE 288 144 192 144
WIRE 448 144 448 -16
WIRE 448 144 432 144
WIRE 544 144 448 144
WIRE 704 144 704 -16
WIRE 704 144 688 144
WIRE 800 144 704 144
WIRE 960 144 960 -16
WIRE 960 144 944 144
WIRE 1184 144 1168 144
WIRE 1408 144 1392 144
WIRE 1616 144 1600 144
WIRE 1840 144 1824 144
WIRE 1888 160 1888 144
WIRE 192 176 176 176
WIRE 448 176 432 176
WIRE 704 176 688 176
WIRE 976 176 944 176
WIRE 1008 176 976 176
WIRE 32 208 16 208
WIRE 288 208 272 208
WIRE 544 208 528 208
WIRE 800 208 784 208
WIRE 1232 208 1232 160
WIRE 1456 208 1456 160
WIRE 1456 208 1232 208
WIRE 1568 208 1456 208
WIRE 1664 208 1664 160
WIRE 1664 208 1568 208
WIRE 1888 208 1888 160
WIRE 1888 208 1664 208
WIRE 2064 208 1888 208
WIRE 128 240 128 224
WIRE 384 240 384 224
WIRE 640 240 640 224
WIRE 896 240 896 224
WIRE 1568 256 1568 208
WIRE 1584 304 1568 304
WIRE 16 336 16 208
WIRE 272 336 272 208
WIRE 272 336 16 336
WIRE 528 336 528 208
WIRE 528 336 272 336
WIRE 784 336 784 208
WIRE 784 336 528 336
WIRE 1520 336 1504 336
WIRE 1568 384 1568 352
WIRE 1584 432 1568 432
WIRE 1520 464 1504 464
WIRE 1568 512 1568 480
WIRE 1584 560 1568 560
WIRE 1520 592 1504 592
WIRE 1568 640 1568 608
WIRE 1584 688 1568 688
WIRE 1520 720 1504 720
WIRE 1568 752 1568 736
FLAG 128 80 VDD
IOPIN 128 80 BiDir
FLAG 128 240 GND
IOPIN 128 240 BiDir
FLAG -48 144 CLK
IOPIN -48 144 In
FLAG 384 80 VDD
IOPIN 384 80 BiDir
FLAG 384 240 GND
IOPIN 384 240 BiDir
FLAG 640 80 VDD
IOPIN 640 80 BiDir
FLAG 640 240 GND
IOPIN 640 240 BiDir
FLAG 896 80 VDD
IOPIN 896 80 BiDir
FLAG 896 240 GND
IOPIN 896 240 BiDir
FLAG 1008 176 OUT
IOPIN 1008 176 Out
FLAG 528 336 CLR
FLAG 976 176 D0
FLAG 704 176 D1
FLAG 448 176 D2
FLAG 192 176 D3
FLAG 1248 112 VDD
IOPIN 1248 112 BiDir
FLAG 1584 304 GND
IOPIN 1584 304 BiDir
FLAG 1232 64 VDD
IOPIN 1232 64 BiDir
FLAG 1584 432 GND
IOPIN 1584 432 BiDir
FLAG 1584 560 GND
IOPIN 1584 560 BiDir
FLAG 1584 688 GND
IOPIN 1584 688 BiDir
FLAG 1568 752 GND
IOPIN 1568 752 BiDir
FLAG 1472 112 VDD
IOPIN 1472 112 BiDir
FLAG 1456 64 VDD
IOPIN 1456 64 BiDir
FLAG 1680 112 VDD
IOPIN 1680 112 BiDir
FLAG 1664 64 VDD
IOPIN 1664 64 BiDir
FLAG 1904 112 VDD
IOPIN 1904 112 BiDir
FLAG 1888 64 VDD
IOPIN 1888 64 BiDir
FLAG 1168 144 D0
FLAG 1392 144 D1
FLAG 1600 144 D2
FLAG 1824 144 D3
FLAG 1504 336 D0
FLAG 1504 464 D1
FLAG 1504 592 D2
FLAG 1504 720 D3
FLAG 2064 208 CLR
SYMBOL FFD 112 176 R0
SYMATTR InstName X1
SYMBOL FFD 368 176 R0
SYMATTR InstName X2
SYMBOL FFD 624 176 R0
SYMATTR InstName X3
SYMBOL FFD 880 176 R0
SYMATTR InstName X4
SYMBOL pmos4 1184 64 R0
SYMATTR InstName M1
SYMATTR Value2 l=600n w=3u
SYMATTR Value PFET
SYMBOL nmos4 1520 256 R0
SYMATTR InstName M2
SYMATTR Value2 l=600n w=12u
SYMATTR Value NFET
SYMBOL nmos4 1520 384 R0
SYMATTR InstName M3
SYMATTR Value2 l=600n w=12u
SYMATTR Value NFET
SYMBOL nmos4 1520 512 R0
SYMATTR InstName M4
SYMATTR Value2 l=600n w=12u
SYMATTR Value NFET
SYMBOL nmos4 1520 640 R0
SYMATTR InstName M5
SYMATTR Value2 l=600n w=12u
SYMATTR Value NFET
SYMBOL pmos4 1408 64 R0
SYMATTR InstName M6
SYMATTR Value2 l=600n w=3u
SYMATTR Value PFET
SYMBOL pmos4 1616 64 R0
SYMATTR InstName M7
SYMATTR Value2 l=600n w=3u
SYMATTR Value PFET
SYMBOL pmos4 1840 64 R0
SYMATTR InstName M8
SYMATTR Value2 l=600n w=3u
SYMATTR Value PFET
TEXT -120 600 Left 2 !.include "ami05.txt"

buffer.asc, the sub-circuit schematic file:
Version 4
SHEET 1 880 680
WIRE 48 -80 48 -112
WIRE 128 -80 48 -80
WIRE 336 -80 336 -112
WIRE 416 -80 336 -80
WIRE 48 -48 48 -80
WIRE 336 -48 336 -80
WIRE 128 0 128 -80
WIRE 128 0 48 0
WIRE 416 0 416 -80
WIRE 416 0 336 0
WIRE 0 32 -32 32
WIRE 288 32 256 32
WIRE 48 80 48 48
WIRE 160 80 48 80
WIRE 336 80 336 48
WIRE 368 80 336 80
WIRE -32 112 -32 32
WIRE -32 112 -64 112
WIRE 48 112 48 80
WIRE 160 112 160 80
WIRE 256 112 256 32
WIRE 256 112 160 112
WIRE 336 112 336 80
WIRE 128 160 48 160
WIRE 416 160 336 160
WIRE -32 192 -32 112
WIRE 0 192 -32 192
WIRE 256 192 256 112
WIRE 288 192 256 192
WIRE 48 240 48 208
WIRE 128 240 128 160
WIRE 128 240 48 240
WIRE 336 240 336 208
WIRE 416 240 416 160
WIRE 416 240 336 240
WIRE 48 272 48 240
WIRE 336 272 336 240
FLAG 336 -112 VDD
IOPIN 336 -112 BiDir
FLAG 336 272 GND
IOPIN 336 272 BiDir
FLAG 368 80 OUT
IOPIN 368 80 Out
FLAG 48 -112 VDD
IOPIN 48 -112 BiDir
FLAG 48 272 GND
IOPIN 48 272 BiDir
FLAG -64 112 IN
IOPIN -64 112 In
SYMBOL pmos4 288 -48 R0
SYMATTR InstName M1
SYMATTR Value PFET
SYMATTR Value2 l=0.6u w=3u
SYMBOL nmos4 288 112 R0
SYMATTR InstName M2
SYMATTR Value NFET
SYMATTR Value2 l=0.6u w=1.5u
SYMBOL pmos4 0 -48 R0
SYMATTR InstName M3
SYMATTR Value PFET
SYMATTR Value2 l=0.6u w=3u
SYMBOL nmos4 0 112 R0
SYMATTR InstName M4
SYMATTR Value NFET
SYMATTR Value2 l=0.6u w=1.5u
TEXT -296 280 Left 2 !.include "ami05.txt"

The netlist it stands for:
* pll.asc
V1 VDD 0 5
V2 CLKA 0 PULSE(0 5 0 10p 10p 33.333n 66.666n)
XX1 CLKA N004 0 N001 VDD chargepump
XX2 N001 0 N002 f_l
XX3 N002 0 N003 VDD vco
XX4 N003 N005 0 VDD divisor
XX6 N005 0 N004 VDD buffer

* block symbol definitions
.subckt chargepump CLKA CLKB GND OUT VDD
M1 VDD Vbp Vbp VDD PFET l=1.2u w=7.8u
M2 Vbn Vbn GND GND NFET l=1.2u w=2.4u
R1 VDD Vbn 385k
M3 N003 Vbn GND GND NFET l=1.2u w=2.4u
XX1 CLKA CLKB down GND _up VDD phasedetector
M12 VDD Vbp Vbp VDD pfet l=1.2u w=7.8u
M13 Vbp Vbn GND GND nfet l=1.2u w=2.4u
M4 VDD N001 N001 VDD PFET l=1.2u w=7.8u
M5 N004 N004 GND GND NFET l=1.2u w=2.4u
M6 Vbp VDD N004 GND NFET l=0.6u w=1.5u
M7 N001 GND N003 VDD PFET l=0.6u w=3u
M8 VDD N001 N002 VDD PFET l=1.2u w=7.8u
M9 N002 _up OUT VDD PFET l=0.6u w=3u
M10 N005 N004 GND GND NFET l=1.2u w=2.4u
M11 OUT down N005 GND NFET l=0.6u w=1.5u
.include "ami05.txt"
.ends chargepump

.subckt phasedetector CLKA CLKB DOWN GND _UP VDD
XX1 N001 CLKA VDD UP _UP GND VDD ffd
XX2 N001 CLKB VDD DOWN NC_01 GND VDD ffd
XX3 UP DOWN GND N001 VDD nand
.ends phasedetector

.subckt ffd _CLR CLK D Q _Q GND VDD
M1 N001 PHI D VDD PFET l=600n w=6u
M9 D _PHI N001 GND NFET l=600n w=3u
M19 VDD _PHI PHI VDD PFET l=600n w=3u
M20 PHI _PHI GND GND NFET l=600n w=1.5u
M2 VDD N002 N003 VDD PFET l=600n w=6u
M3 N003 _PHI N004 VDD PFET l=600n w=6u
M4 N004 PHI N005 GND NFET l=600n w=3u
M5 N005 N002 GND GND NFET l=600n w=3u
M6 VDD N002 N006 VDD PFET l=600n w=6u
M7 N006 _PHI N001 VDD PFET l=600n w=6u
M8 N001 PHI N008 GND NFET l=600n w=3u
M10 N008 N002 GND GND NFET l=600n w=3u
M15 VDD _Q N007 VDD PFET l=600n w=6u
M16 N007 PHI N004 VDD PFET l=600n w=6u
M25 N004 _PHI N009 GND NFET l=600n w=3u
M26 N009 _Q GND GND NFET l=600n w=3u
M27 VDD _Q Q VDD PFET l=600n w=3u
M28 Q _Q GND GND NFET l=600n w=1.5u
XX1 _CLR N001 GND N002 VDD nand
XX2 N004 _CLR GND _Q VDD nand
M11 VDD CLK _PHI VDD PFET l=600n w=3u
M12 _PHI CLK GND GND NFET l=600n w=1.5u
.include "ami05.txt"
.tran 100u
* 4
.ends ffd

.subckt nand A B GND OUT VDD
M1 VDD B OUT VDD PFET l=600n w=3u
M2 OUT B N001 GND NFET l=600n w=3u
M3 N001 A GND GND NFET l=600n w=3u
M4 VDD A OUT VDD PFET l=600n w=3u
.include "ami05.txt"
.ends nand

.subckt f_l I_PCD GND V_CTRL
R1 I_PCD N001 38.8k
R2 V_CTRL I_PCD 1m
C1 N001 GND 10p
.ends f_l

.subckt vco Vctrl GND OUT VDD
M1 N001 UNO N006 VDD PFET l=0.9u w=3u
M2 N006 UNO N011 GND NFET l=0.9u w=1.5u
M11 VDD UNO N010 VDD PFET l=0.6u w=3u
M12 N010 UNO GND GND NFET l=0.6u w=1.5u
M13 VDD N010 OUT VDD PFET l=0.6u w=3u
M14 OUT N010 GND GND NFET l=0.6u w=1.5u
M15 Vbp Vbp VDD VDD PFET l=0.9u w=6.3u
M16 Vbp Vctrl N016 GND NFET l=0.6u w=5.1u
M17 Vbn Vbp VDD VDD PFET l=0.9u w=6.3u
M18 Vbn Vbn GND GND NFET l=0.9u w=2.1u
R1 N016 GND 5.2k
M19 N001 Vbp VDD VDD PFET l=0.9u w=6.3u
M20 N002 Vbp VDD VDD PFET l=0.9u w=6.3u
M21 N003 Vbp VDD VDD PFET l=0.9u w=6.3u
M22 N004 Vbp VDD VDD PFET l=0.9u w=6.3u
M23 N005 Vbp VDD VDD PFET l=0.9u w=6.3u
M24 N011 Vbn GND GND NFET l=0.9u w=2.1u
M25 N012 Vbn GND GND NFET l=0.9u w=2.1u
M26 N013 Vbn GND GND NFET l=0.9u w=2.1u
M27 N014 Vbn GND GND NFET l=0.9u w=2.1u
M28 N015 Vbn GND GND NFET l=0.9u w=2.1u
M7 N002 N006 N007 VDD PFET l=0.9u w=3u
M8 N003 N007 N008 VDD PFET l=0.9u w=3u
M9 N004 N008 N009 VDD PFET l=0.9u w=3u
M10 N005 N009 UNO VDD PFET l=0.9u w=3u
M3 N007 N006 N012 GND NFET l=0.9u w=1.5u
M4 N008 N007 N013 GND NFET l=0.9u w=1.5u
M5 N009 N008 N014 GND NFET l=0.9u w=1.5u
M6 UNO N009 N015 GND NFET l=0.9u w=1.5u
.include "ami05.txt"
* K=290
.ends vco

.subckt divisor CLK OUT GND VDD
XX1 CLR CLK N001 D3 N001 GND VDD ffd
XX2 CLR N001 N002 D2 N002 GND VDD ffd
XX3 CLR N002 N003 D1 N003 GND VDD ffd
XX4 CLR N003 N004 OUT N004 GND VDD ffd
M1 VDD OUT CLR VDD PFET l=600n w=3u
M2 CLR OUT N005 GND NFET l=600n w=12u
M3 N005 D1 N006 GND NFET l=600n w=12u
M4 N006 D2 N007 GND NFET l=600n w=12u
M5 N007 D3 GND GND NFET l=600n w=12u
M6 VDD D1 CLR VDD PFET l=600n w=3u
M7 VDD D2 CLR VDD PFET l=600n w=3u
M8 VDD D3 CLR VDD PFET l=600n w=3u
.include "ami05.txt"
.ends divisor

.subckt buffer IN GND OUT VDD
M1 VDD N001 OUT VDD PFET l=0.6u w=3u
M2 OUT N001 GND GND NFET l=0.6u w=1.5u
M3 VDD IN N001 VDD PFET l=0.6u w=3u
M4 N001 IN GND GND NFET l=0.6u w=1.5u
.include "ami05.txt"
.ends buffer

.model NMOS NMOS
.model PMOS PMOS
.lib standard.mos
.tran 10u
.backanno
.end